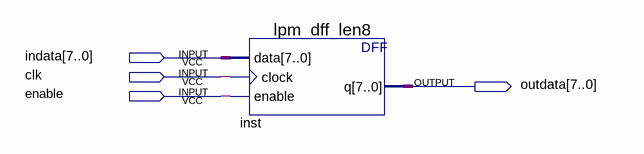
[diagram p0: schematic sheet]
// Quartus schematic Slave.bdf as structural Verilog: 1 symbols, 4 pins
module Slave (
  input  [7:0] indata,
  input  clk,
  input  enable,
  output [7:0] outdata
);

  lpm_dff_len8 inst (.data(indata), .clock(clk), .enable(enable), .q(outdata));
endmodule
